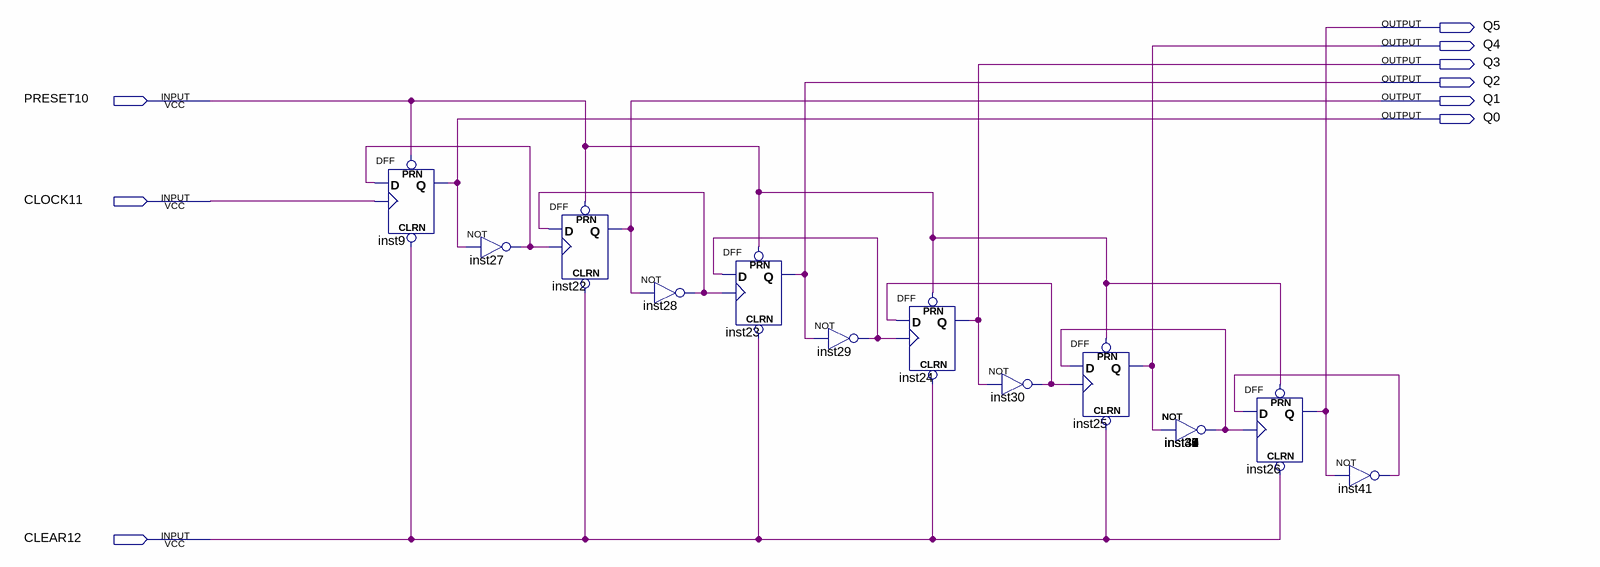
[diagram p0: schematic sheet]
// Quartus schematic 4_esc_flipflops.bdf as structural Verilog: 21 symbols, 9 pins
module \4_esc_flipflops  (
  input  PRESET10,
  input  CLOCK11,
  input  CLEAR12,
  output Q5,
  output Q4,
  output Q3,
  output Q2,
  output Q1,
  output Q0
);

  wire inst27_out, inst28_out, inst29_out, inst30_out, inst31_out, inst41_out;

  DFF inst9 (.CLRN(CLEAR12), .CLK(CLOCK11), .D(inst27_out), .PRN(PRESET10), .Q(Q0));
  not inst27 (inst27_out, Q0);
  DFF inst22 (.CLRN(CLEAR12), .CLK(inst27_out), .D(inst28_out), .PRN(PRESET10), .Q(Q1));
  not inst28 (inst28_out, Q1);
  DFF inst23 (.CLRN(CLEAR12), .CLK(inst28_out), .D(inst29_out), .PRN(PRESET10), .Q(Q2));
  not inst29 (inst29_out, Q2);
  DFF inst24 (.CLRN(CLEAR12), .CLK(inst29_out), .D(inst30_out), .PRN(PRESET10), .Q(Q3));
  not inst30 (inst30_out, Q3);
  DFF inst25 (.CLRN(CLEAR12), .CLK(inst30_out), .D(inst31_out), .PRN(PRESET10), .Q(Q4));
  not inst31 (inst31_out, Q4);
  not inst32 (inst31_out, Q4);
  not inst33 (inst31_out, Q4);
  not inst34 (inst31_out, Q4);
  not inst35 (inst31_out, Q4);
  not inst36 (inst31_out, Q4);
  not inst37 (inst31_out, Q4);
  not inst38 (inst31_out, Q4);
  not inst39 (inst31_out, Q4);
  not inst40 (inst31_out, Q4);
  DFF inst26 (.CLRN(CLEAR12), .CLK(inst31_out), .D(inst41_out), .PRN(PRESET10), .Q(Q5));
  not inst41 (inst41_out, Q5);
endmodule
